# Altium schematic sheet comms_ERC.SchDoc
size A4; SheetNumber: 1; SheetTotal: 1
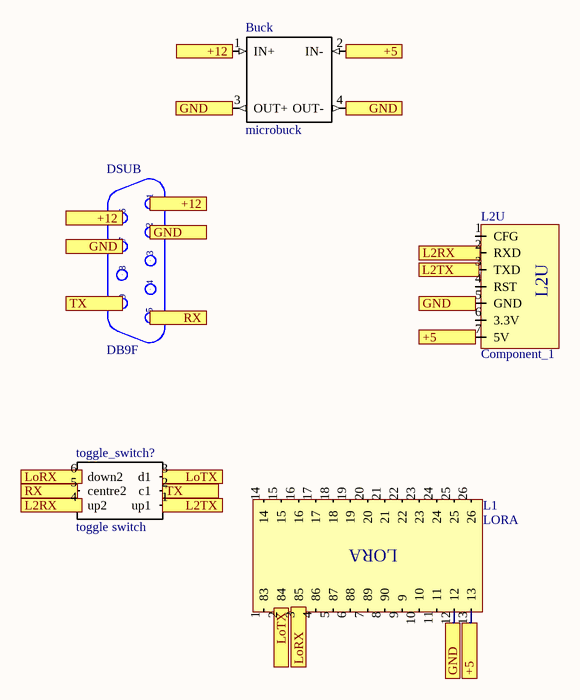
[diagram p0: comms_ERC.SchDoc]

## Parts
Buck  microbuck  [Micro buck]
DSUB  DB9F  [D-09F]
L1  LORA  [PCBComponent_1]
L2U  Component_1  [PCBComponent_1]
toggle_switch?  toggle switch  [toggle switch]

## Ports
+5, +12, GND, L2RX, L2TX, LoRX, LoTX, RX, TX

## Nets
+5: Buck.2(IN-) L1.13 L2U.7(5V) ; port +5
+12: Buck.1(IN+) DSUB.1 DSUB.6 ; port +12
GND: Buck.3(OUT+) Buck.4(OUT-) DSUB.2 DSUB.7 L1.12 L2U.5(GND) ; port GND
L2TX: toggle_switch?.1(up1) ; port L2TX
LoTX: toggle_switch?.3(d1) ; port LoTX
RX: DSUB.5 toggle_switch?.5(centre2) ; port RX
TX: DSUB.9 toggle_switch?.2(c1) ; port TX

Not connected (* = marked no-connect by the designer): DSUB 3 4 8; L1 1(83) 2(84) 3(85) 4(86) 5(87) 6(88) 7(89) 8(90) 9 10 11 14 15 16 17 18 19 20 21 22 23 24 25 26; L2U 1(CFG) 2(RXD) 3(TXD) 4(RST) 6(3.3V); toggle_switch? 4(up2) 6(down2)

## Library data of the parts
DSUB = DB9F: Adapter Connector D-Sub, 9 Pin Female To Modular, Female Jack, 8p8c _RJ45_ Beige; MF: Assmann WSW; SnapEDA_Link: https://www.snapeda.com/parts/DB9F/Assmann%20WSW%20Components/view-part/558712/?ref=snap; MP: DB9F; Availability: Unavailable; Price: None; Value: *; Package: None
L2U = Component_1: L2T